# Altium schematic sheet SCH_BUTTON.SchDoc
size A3; SheetNumber: 4; SheetTotal: 10
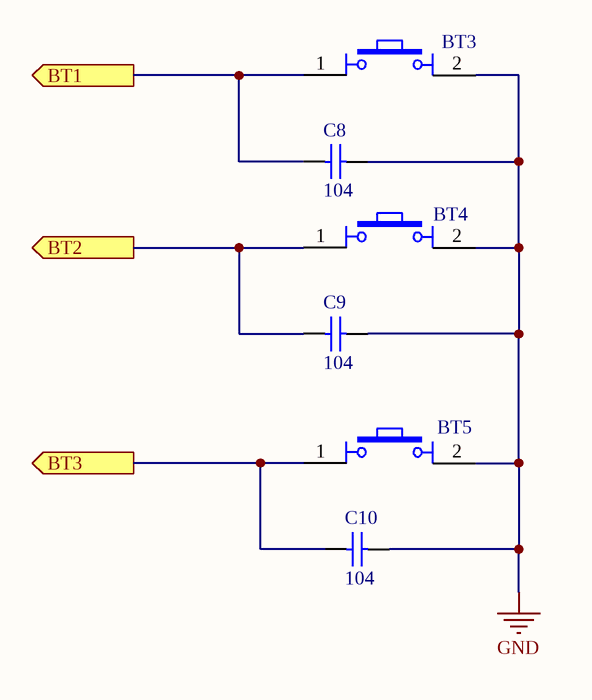
[diagram p0: SCH_BUTTON.SchDoc]

## Parts
BT3  (no value)  [Nut Nhan 4 Chan Cam 6x6]
BT4  (no value)  [Nut Nhan 4 Chan Cam 6x6]
BT5  (no value)  [Nut Nhan 4 Chan Cam 6x6]
C8  104  [tu 0805]
C9  104  [tu 0805]
C10  104  [tu 0805]

## Ports
BT1 (out), BT2 (out), BT3 (out)

## Nets
GND: BT3.2 BT4.2 BT5.2 C8.2 C9.2 C10.2
BT1: BT3.1 C8.1 ; port BT1
BT2: BT4.1 C9.1 ; port BT2
BT3: BT5.1 C10.1 ; port BT3

## Library data of the parts
BT3-BT5 = Nut Nhan 4 Chan Cam 6x6: Nut Nhan 4 Chan 6x6mm; Ten: Nút Nhấn 4 Chân 6x6x5MM DIP; Ma_Hang: MH004584
C8-C10 = Tu 0805 104 50V 10%: Dán; Don_Vi: Con; So_Chan: 2; Ten_Linh_Kien: Tụ 0805 104-100nF 10% 50V; Ma_Hang: MH004551; Chung_Loai: Dán; Kieu_Chan: *